# EAGLE design double100 (EAGLE 6.6.0)
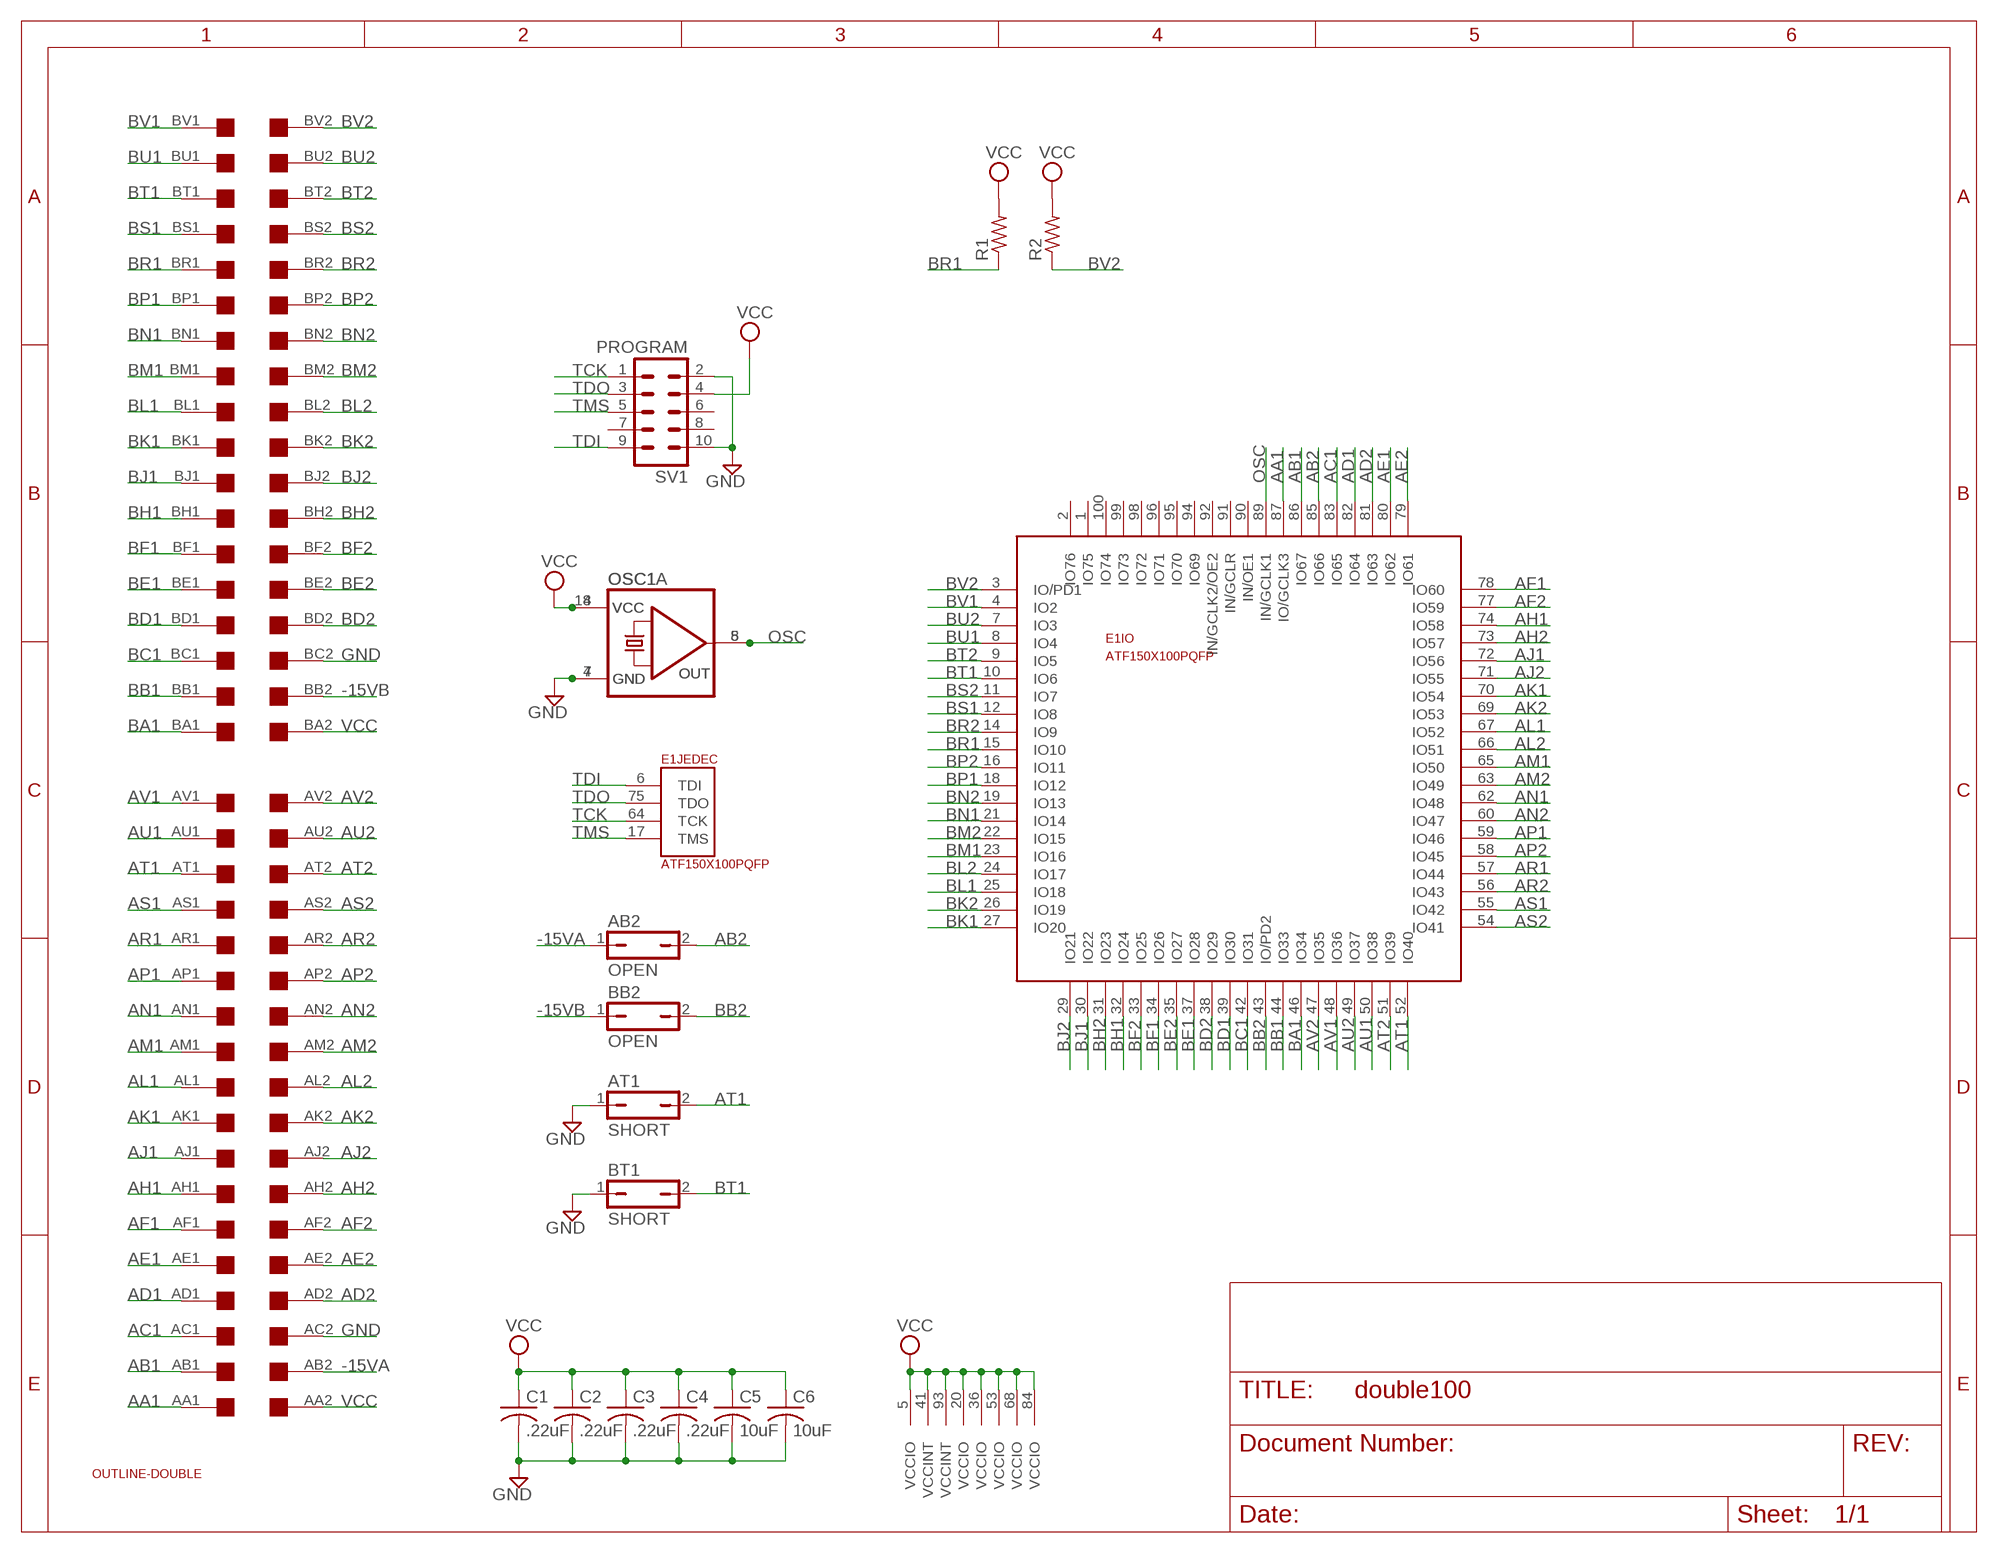
[diagram p0: schematic, sheet 1]

## Parts
AB2  OPEN  JP1Q  [JP1]
AT1  SHORT  JP1Q  [JP1]
BB2  OPEN  JP1Q  [JP1]
BT1  SHORT  JP1Q  [JP1]
C1  .22uF  C-USC0805  [C0805]
C2  .22uF  C-USC0805  [C0805]
C3  .22uF  C-USC0805  [C0805]
C4  .22uF  C-USC0805  [C0805]
C5  10uF  C-USC0805  [C0805]
C6  10uF  C-USC0805  [C0805]
E1  ATF150X100PQFP  [PQFP-100]
OSC1  QG5460  [DIL08S]
OSC1A  QG5860  [DIL14S]
R1  R-US_0207/10  [0207/10]
R2  R-US_0207/10  [0207/10]
SV1  PROGRAM  ML10  [ML10]
U$1  DOUBLE  [EDGE-CON4]
U$3  OUTLINE-DOUBLE  [DOUBLE]

## Nets
-15VA: AB2.1 U$1.AB2
-15VB: BB2.1 U$1.BB2
AA1: E1.87(IO:IO/GCLK3) U$1.AA1
AB1: E1.86(IO:IO67) U$1.AB1
AB2: AB2.2 E1.85(IO:IO66)
AC1: E1.83(IO:IO65) U$1.AC1
AD1: E1.82(IO:IO64) U$1.AD1
AD2: E1.81(IO:IO63) U$1.AD2
AE1: E1.80(IO:IO62) U$1.AE1
AE2: E1.79(IO:IO61) U$1.AE2
AF1: E1.78(IO:IO60) U$1.AF1
AF2: E1.77(IO:IO59) U$1.AF2
AH1: E1.74(IO:IO58) U$1.AH1
AH2: E1.73(IO:IO57) U$1.AH2
AJ1: E1.72(IO:IO56) U$1.AJ1
AJ2: E1.71(IO:IO55) U$1.AJ2
AK1: E1.70(IO:IO54) U$1.AK1
AK2: E1.69(IO:IO53) U$1.AK2
AL1: E1.67(IO:IO52) U$1.AL1
AL2: E1.66(IO:IO51) U$1.AL2
AM1: E1.65(IO:IO50) U$1.AM1
AM2: E1.63(IO:IO49) U$1.AM2
AN1: E1.62(IO:IO48) U$1.AN1
AN2: E1.60(IO:IO47) U$1.AN2
AP1: E1.59(IO:IO46) U$1.AP1
AP2: E1.58(IO:IO45) U$1.AP2
AR1: E1.57(IO:IO44) U$1.AR1
AR2: E1.56(IO:IO43) U$1.AR2
AS1: E1.55(IO:IO42) U$1.AS1
AS2: E1.54(IO:IO41) U$1.AS2
AT1: AT1.2 E1.52(IO:IO40) U$1.AT1
AT2: E1.51(IO:IO39) U$1.AT2
AU1: E1.50(IO:IO38) U$1.AU1
AU2: E1.49(IO:IO37) U$1.AU2
AV1: E1.48(IO:IO36) U$1.AV1
AV2: E1.47(IO:IO35) U$1.AV2
BA1: E1.46(IO:IO34) U$1.BA1
BB1: E1.44(IO:IO33) U$1.BB1
BB2: BB2.2 E1.43(IO:IO/PD2)
BC1: E1.42(IO:IO31) U$1.BC1
BD1: E1.39(IO:IO30) U$1.BD1
BD2: E1.38(IO:IO29) U$1.BD2
BE1: E1.37(IO:IO28) U$1.BE1
BE2: E1.35(IO:IO27) U$1.BE2
BF1: E1.34(IO:IO26) U$1.BF1
BF2: E1.33(IO:IO25) U$1.BF2
BH1: E1.32(IO:IO24) U$1.BH1
BH2: E1.31(IO:IO23) U$1.BH2
BJ1: E1.30(IO:IO22) U$1.BJ1
BJ2: E1.29(IO:IO21) U$1.BJ2
BK1: E1.27(IO:IO20) U$1.BK1
BK2: E1.26(IO:IO19) U$1.BK2
BL1: E1.25(IO:IO18) U$1.BL1
BL2: E1.24(IO:IO17) U$1.BL2
BM1: E1.23(IO:IO16) U$1.BM1
BM2: E1.22(IO:IO15) U$1.BM2
BN1: E1.21(IO:IO14) U$1.BN1
BN2: E1.19(IO:IO13) U$1.BN2
BP1: E1.18(IO:IO12) U$1.BP1
BP2: E1.16(IO:IO11) U$1.BP2
BR1: E1.15(IO:IO10) R1.1 U$1.BR1
BR2: E1.14(IO:IO9) U$1.BR2
BS1: E1.12(IO:IO8) U$1.BS1
BS2: E1.11(IO:IO7) U$1.BS2
BT1: BT1.2 E1.10(IO:IO6) U$1.BT1
BT2: E1.9(IO:IO5) U$1.BT2
BU1: E1.8(IO:IO4) U$1.BU1
BU2: E1.7(IO:IO3) U$1.BU2
BV1: E1.4(IO:IO2) U$1.BV1
BV2: E1.3(IO:IO/PD1) R2.1 U$1.BV2
GND: AT1.1 BT1.1 C1.2 C2.2 C3.2 C4.2 C5.2 C6.2 OSC1.4(GND) OSC1A.7(GND) SV1.2 SV1.10 U$1.AC2 U$1.BC2
OSC: E1.89(IO:IN/GCLK1) OSC1.5(OUT) OSC1A.8(OUT)
TCK: E1.64(JEDEC:TCK) SV1.1
TDI: E1.6(JEDEC:TDI) SV1.9
TDO: E1.75(JEDEC:TDO) SV1.3
TMS: E1.17(JEDEC:TMS) SV1.5
VCC: C1.1 C2.1 C3.1 C4.1 C5.1 C6.1 E1.5(VCCIO) E1.20(VCCIO) E1.36(VCCIO) E1.41(VCCINT) E1.53(VCCIO) E1.68(VCCIO) E1.84(VCCIO) E1.93(VCCINT) OSC1.8(VCC) OSC1A.14(VCC) R1.2 R2.2 SV1.4 U$1.AA2 U$1.BA2
Unconnected: E1.1(IO:IO75) E1.2(IO:IO76) E1.90(IO:IN/OE1) E1.91(IO:IN/GCLR) E1.92(IO:IN/GCLK2/OE2) E1.94(IO:IO69) E1.95(IO:IO70) E1.96(IO:IO71) E1.98(IO:IO72) E1.99(IO:IO73) E1.100(IO:IO74) SV1.6 SV1.7 SV1.8

## Power pins joined to a net without a drawn wire
GND: E1.13(GND) E1.28(GND) E1.40(GND) E1.45(GND) E1.61(GND) E1.76(GND) E1.88(GND) E1.97(GND)

## Library data of the parts
AB2 AT1 BB2 BT1 = jumper:JP1Q: JUMPER
C1-C6 = rcl:C-US: CAPACITOR, American symbol
E1 = atmel-cpld:ATF150X100: ATF150x in 100 pin package.
OSC1 = crystal:QG5460: CRYSTAL RESONATOR; OC_FARNELL: unknown; OC_NEWARK: unknown
OSC1A = crystal:QG5860: CRYSTAL RESONATOR; OC_FARNELL: unknown; OC_NEWARK: unknown
R1 R2 = rcl:R-US_: RESISTOR, American symbol
SV1 = con-harting-ml:ML10: HARTING; OC_FARNELL: unknown; OC_NEWARK: unknown
U$1 = dec-con:DOUBLE: Double-Height DEC board
U$3 = dec-con:OUTLINE-*: Board outlines for DEC boards.

## Net classes
1 Supply: width 0.711 mm

## Board
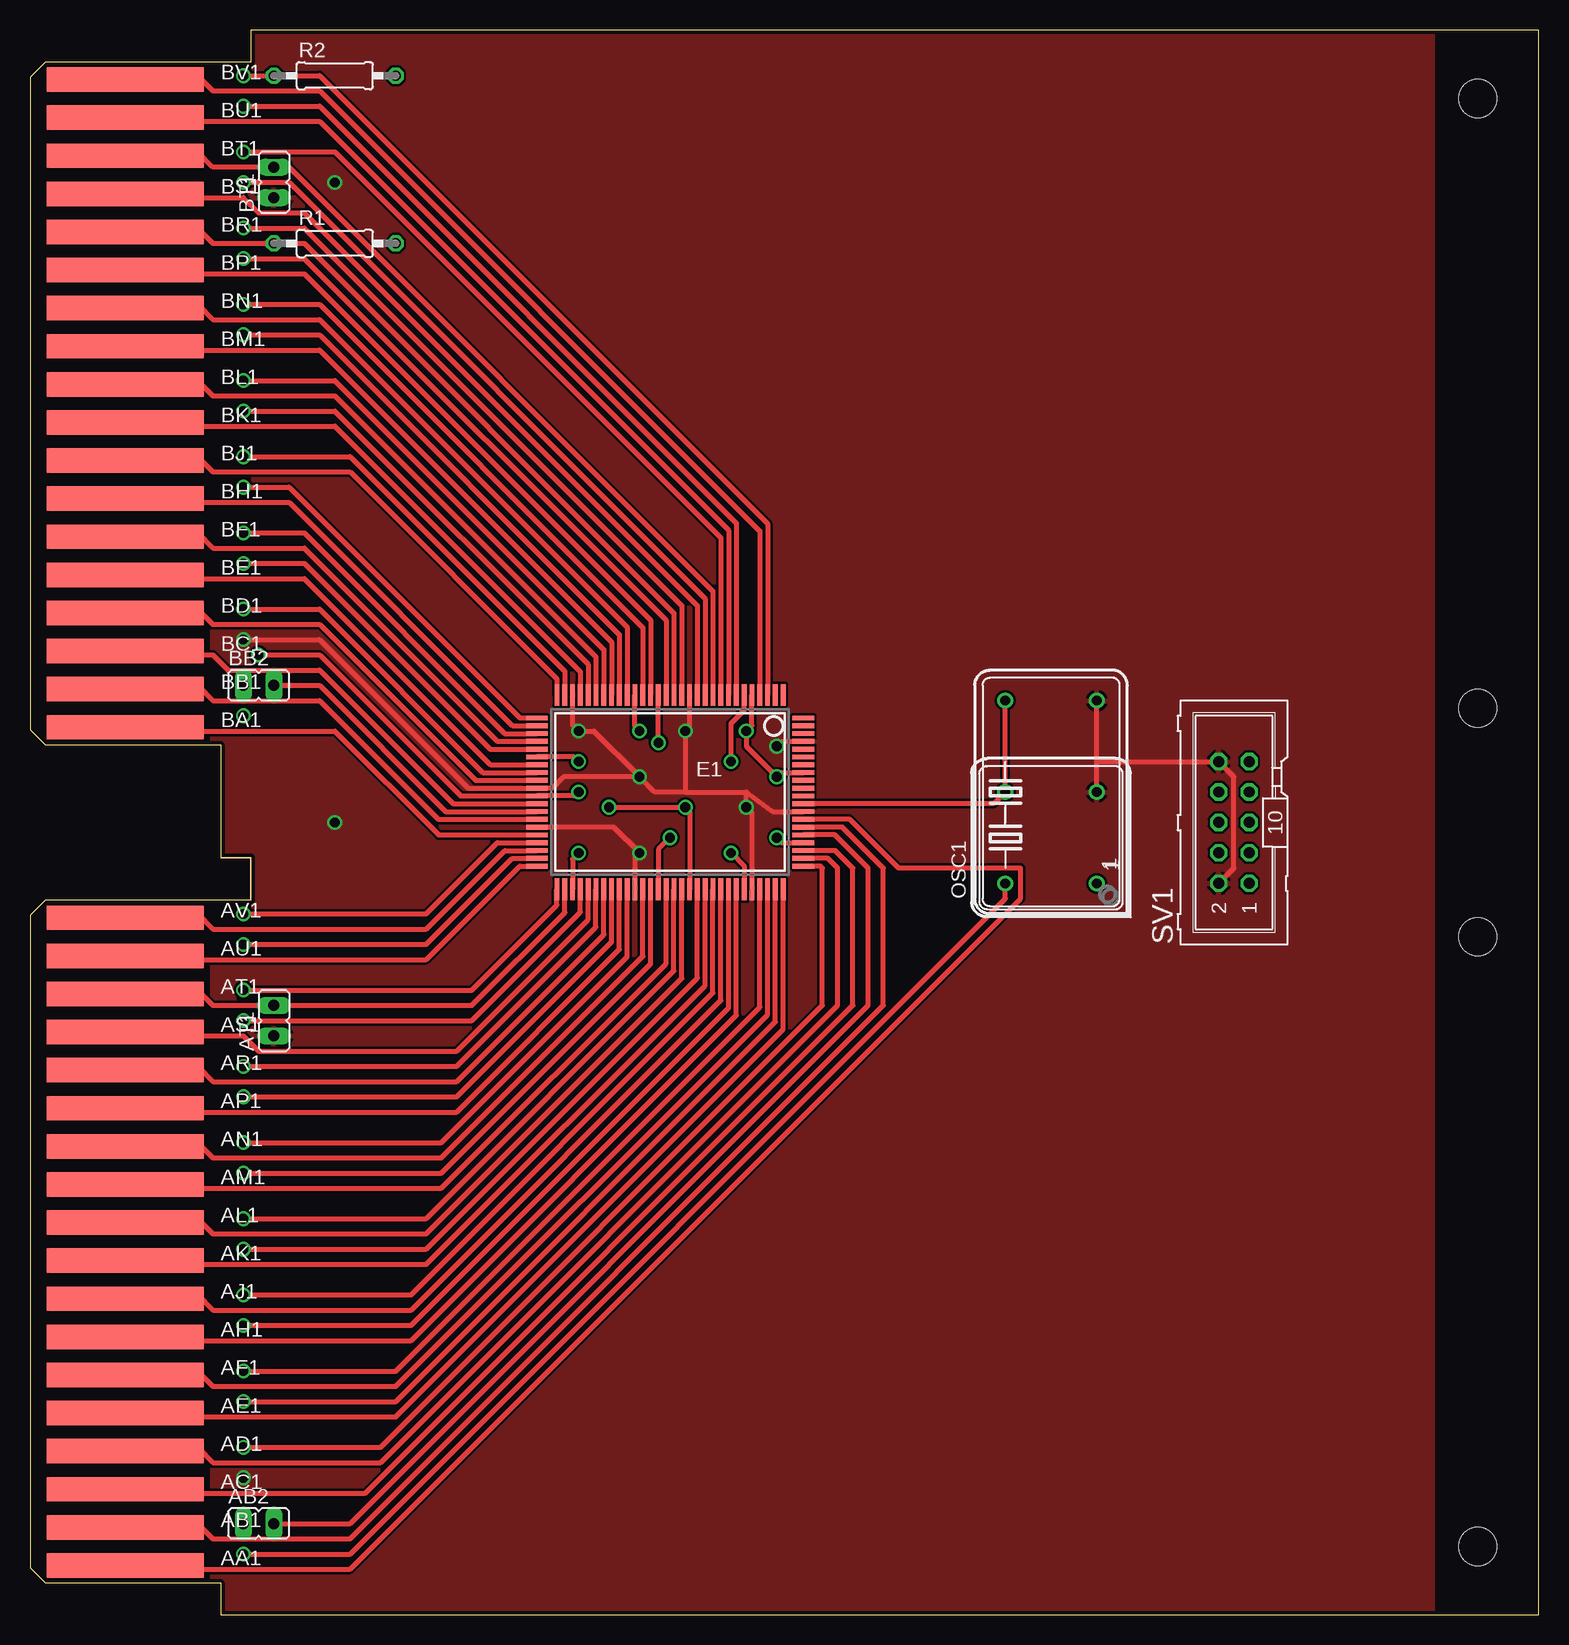
[diagram p1: board, top side]
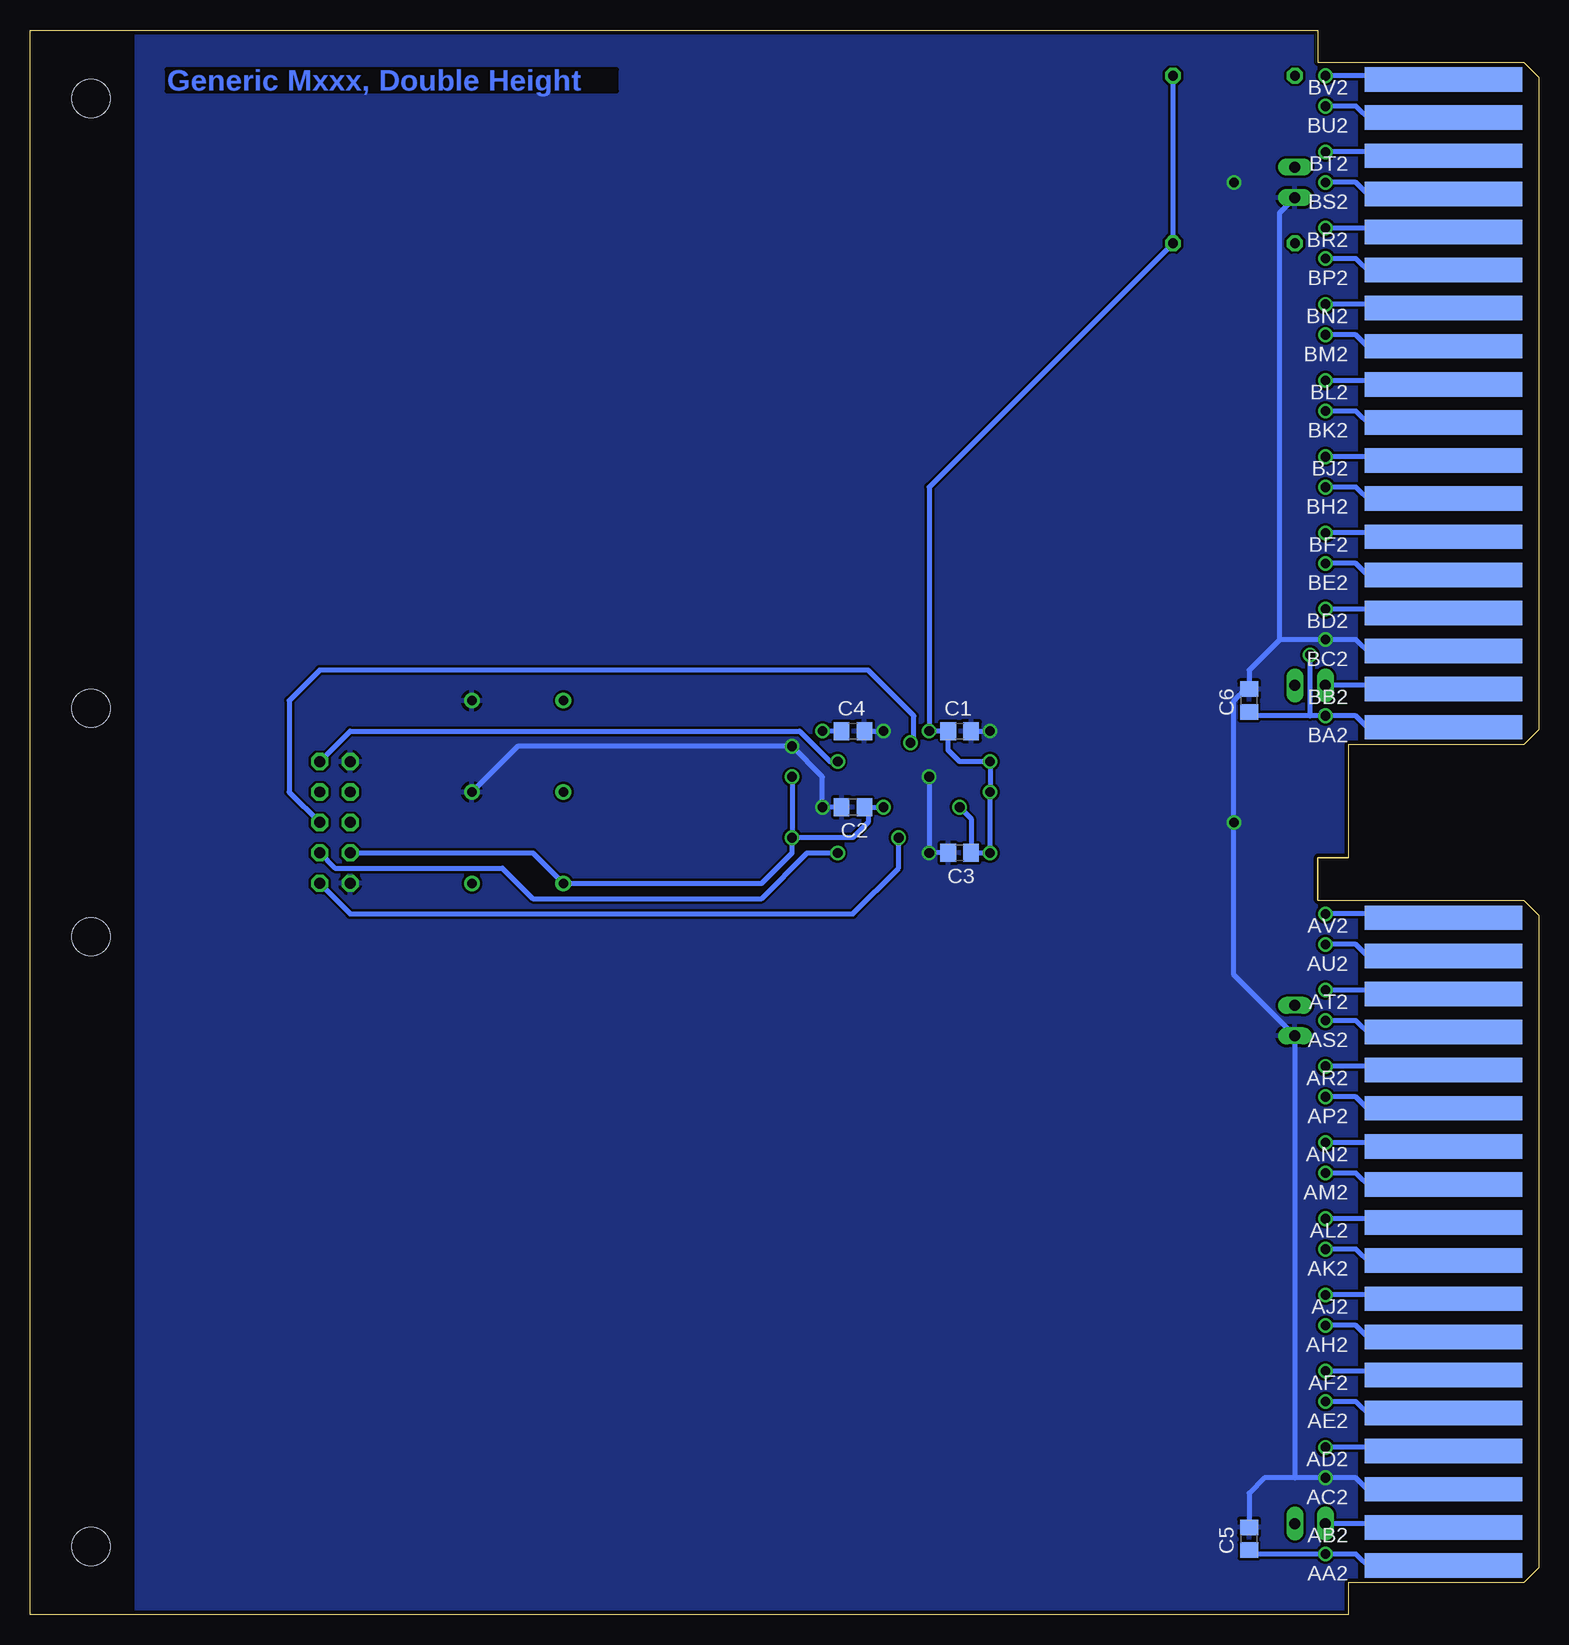
[diagram p2: board, bottom side, seen from below]

Size 125.73 x 132.08 mm. Coordinates in mm from the lower left corner, seen from the top.
Copper layers (1+16): Top 0.035mm / dielectric 1.5mm / Bottom 0.035mm
Design rules "16mils *": minimum track width 15mil, minimum drill 32mil, track to track 8mil, track to pad 8mil, pad to pad 8mil, via to via 10mil, smd to smd 8mil, copper to edge 13mil, drill to drill 10mil, minimum pad ring 10mil, minimum via ring 8mil, stop-mask expansion 0mil, vias tented up to drill 0mil, thermal gap 10mil

### Footprints (pad centres in the part's own frame; a part is rotated, then mirrored left to right if it is on the bottom)
JP1 = drill 0.914 long: 1 0,-1.27; 2 0,1.27
C0805 = smd 1.3 x 1.5: 1 -0.95,0; 2 0.95,0
PQFP-100 = smd 0.4 x 1.8: 1 -9.425,-8.1; 2 -8.775,-8.1; 3 -8.125,-8.1; 4 -7.475,-8.1; 5 -6.825,-8.1; 6 -6.175,-8.1; 7 -5.525,-8.1; 8 -4.875,-8.1; 9 -4.225,-8.1; 10 -3.575,-8.1; 11 -2.925,-8.1; 12 -2.275,-8.1; 13 -1.625,-8.1; 14 -0.975,-8.1; 15 -0.325,-8.1; 16 0.325,-8.1; 17 0.975,-8.1; 18 1.625,-8.1; 19 2.275,-8.1; 20 2.925,-8.1; 21 3.575,-8.1; 22 4.225,-8.1; 23 4.875,-8.1; 24 5.525,-8.1; 25 6.175,-8.1; 26 6.825,-8.1; 27 7.475,-8.1; 28 8.125,-8.1; 29 8.775,-8.1; 30 9.425,-8.1; 51 9.425,8.1; 52 8.775,8.1; 53 8.125,8.1; 54 7.475,8.1; 55 6.825,8.1; 56 6.175,8.1; 57 5.525,8.1; 58 4.875,8.1; 59 4.225,8.1; 60 3.575,8.1; 61 2.925,8.1; 62 2.275,8.1; 63 1.625,8.1; 64 0.975,8.1; 65 0.325,8.1; 66 -0.325,8.1; 67 -0.975,8.1; 68 -1.625,8.1; 69 -2.275,8.1; 70 -2.925,8.1; 71 -3.575,8.1; 72 -4.225,8.1; 73 -4.875,8.1; 74 -5.525,8.1; 75 -6.175,8.1; 76 -6.825,8.1; 77 -7.475,8.1; 78 -8.125,8.1; 79 -8.775,8.1; 80 -9.425,8.1 | smd 1.8 x 0.4: 31 11.1,-6.175; 32 11.1,-5.525; 33 11.1,-4.875; 34 11.1,-4.225; 35 11.1,-3.575; 36 11.1,-2.925; 37 11.1,-2.275; 38 11.1,-1.625; 39 11.1,-0.975; 40 11.1,-0.325; 41 11.1,0.325; 42 11.1,0.975; 43 11.1,1.625; 44 11.1,2.275; 45 11.1,2.925; 46 11.1,3.575; 47 11.1,4.225; 48 11.1,4.875; 49 11.1,5.525; 50 11.1,6.175; 81 -11.1,6.175; 82 -11.1,5.525; 83 -11.1,4.875; 84 -11.1,4.225; 85 -11.1,3.575; 86 -11.1,2.925; 87 -11.1,2.275; 88 -11.1,1.625; 89 -11.1,0.975; 90 -11.1,0.325; 91 -11.1,-0.325; 92 -11.1,-0.975; 93 -11.1,-1.625; 94 -11.1,-2.275; 95 -11.1,-2.925; 96 -11.1,-3.575; 97 -11.1,-4.225; 98 -11.1,-4.875; 99 -11.1,-5.525; 100 -11.1,-6.175
DIL08S = drill 0.813: 1 -3.81,-3.81; 4 3.81,-3.81; 5 3.81,3.81; 8 -3.81,3.81
DIL14S = drill 0.813: 1 -7.62,-3.81; 7 7.62,-3.81; 8 7.62,3.81; 14 -7.62,3.81
0207/10 = drill 0.813 octagon: 1 -5.08,0; 2 5.08,0
ML10 = drill 0.914 octagon: 1 -5.08,-1.27; 2 -5.08,1.27; 3 -2.54,-1.27; 4 -2.54,1.27; 5 0,-1.27; 6 0,1.27; 7 2.54,-1.27; 8 2.54,1.27; 9 5.08,-1.27; 10 5.08,1.27
EDGE-CON4 = smd 13.106 x 2.032: AA1 7.938,4.128; AB1 7.938,7.303; AC1 7.938,10.477; AD1 7.938,13.652; AE1 7.938,16.828; AF1 7.938,20.003; AH1 7.938,23.177; AJ1 7.938,26.352; AK1 7.938,29.527; AL1 7.938,32.703; AM1 7.938,35.877; AN1 7.938,39.053; AP1 7.938,42.227; AR1 7.938,45.403; AS1 7.938,48.578; AT1 7.938,51.752; AU1 7.938,54.928; AV1 7.938,58.102; BA1 7.938,73.978; BB1 7.938,77.153; BC1 7.938,80.328; BD1 7.938,83.502; BE1 7.938,86.677; BF1 7.938,89.853; BH1 7.938,93.028; BJ1 7.938,96.203; BK1 7.938,99.377; BL1 7.938,102.552; BM1 7.938,105.728; BN1 7.938,108.903; BP1 7.938,112.078; BR1 7.938,115.252; BS1 7.938,118.427; BT1 7.938,121.603; BU1 7.938,124.778; BV1 7.938,127.953 | smd 13.106 x 2.032 bottom: AA2 7.938,4.128; AB2 7.938,7.303; AC2 7.938,10.477; AD2 7.938,13.652; AE2 7.938,16.828; AF2 7.938,20.003; AH2 7.938,23.177; AJ2 7.938,26.352; AK2 7.938,29.527; AL2 7.938,32.703; AM2 7.938,35.877; AN2 7.938,39.053; AP2 7.938,42.227; AR2 7.938,45.403; AS2 7.938,48.578; AT2 7.938,51.752; AU2 7.938,54.928; AV2 7.938,58.102; BA2 7.938,73.978; BB2 7.938,77.153; BC2 7.938,80.328; BD2 7.938,83.502; BE2 7.938,86.677; BF2 7.938,89.853; BH2 7.938,93.028; BJ2 7.938,96.203; BK2 7.938,99.377; BL2 7.938,102.552; BM2 7.938,105.728; BN2 7.938,108.903; BP2 7.938,112.078; BR2 7.938,115.252; BS2 7.938,118.427; BT2 7.938,121.603; BU2 7.938,124.778; BV2 7.938,127.953
DOUBLE = hole 3.175: 120.65,56.515; 120.65,5.715; 120.65,75.565; 120.65,126.365

### Placement (x,y rotation side)
AB2  19.05,7.62 270 top
AT1  20.32,49.53 0 top
BB2  19.05,77.47 270 top
BT1  20.32,119.38 0 top
C1  48.26,73.66 0 bottom
C2  57.15,67.31 180 bottom
C3  48.26,63.5 180 bottom
C4  57.15,73.66 0 bottom
C5  24.13,6.35 90 bottom
C6  24.13,76.2 90 bottom
E1  53.34,68.58 180 top
OSC1  85.09,64.77 90 top
OSC1A  85.09,68.58 90 top
R1  25.4,114.3 0 top
R2  25.4,128.27 0 top
SV1  100.33,66.04 90 top
U$1  0,0 0 top
U$3  0,0 0 top

### Tracks (layer width: path | path; a pad name or v marks a point on that pad's centre or on a via)
-15VA
  Bottom 0.406: U$1.AB2 8.26,7.62 AB2.1
-15VB
  Bottom 0.406: U$1.BB2 8.26,77.47 BB2.1
AA1
  Top 0.406: U$1.AA1 8.26,3.81 26.67,3.81 82.55,59.69 82.55,62.23 72.39,62.23 68.32,66.31 E1.87
AB1
  Top 0.406: U$1.AB1 8.26,7.62 13.97,7.62 15.24,6.35 26.67,6.35 71.12,50.8 71.12,62.23 67.7,65.66 E1.86
AB2
  Top 0.406: AB2.2 26.67,7.62 69.85,50.8 69.85,62.23 67.08,65 E1.85
AC1
  Top 0.406: U$1.AC1 8.26,10.16 27.94,10.16 68.58,50.8 68.58,62.23 67.11,63.7 E1.83
AD1
  Top 0.406: U$1.AD1 8.26,13.97 13.97,13.97 15.24,12.7 29.21,12.7 67.31,50.8 67.31,62.23 66.49,63.05 E1.82
AD2  (via drill 0.81)
  Top 0.406: v17.78,13.97 29.21,13.97 66.04,50.8 66.04,62.23 65.87,62.41 E1.81
  Bottom 0.406: U$1.AD2 8.26,13.97 v17.78,13.97
AE1
  Top 0.406: U$1.AE1 8.26,16.51 30.48,16.51 62.77,48.8 E1.80
AE2  (via drill 0.81)
  Top 0.406: v17.78,17.78 30.48,17.78 62.12,49.41 E1.79
  Bottom 0.406: U$1.AE2 8.26,16.51 13.97,16.51 15.24,17.78 v17.78,17.78
AF1
  Top 0.406: U$1.AF1 8.26,20.32 13.97,20.32 15.24,19.05 30.48,19.05 61.47,50.03 E1.78
AF2  (via drill 0.81)
  Top 0.406: v17.78,20.32 30.48,20.32 60.82,50.66 E1.77
  Bottom 0.406: U$1.AF2 8.26,20.32 v17.78,20.32
AH1
  Top 0.406: U$1.AH1 8.26,22.86 31.75,22.86 58.87,49.98 E1.74
AH2  (via drill 0.81)
  Top 0.406: v17.78,24.13 31.75,24.13 58.22,50.59 E1.73
  Bottom 0.406: U$1.AH2 8.26,22.86 13.97,22.86 15.24,24.13 v17.78,24.13
AJ1
  Top 0.406: U$1.AJ1 8.26,26.67 13.97,26.67 15.24,25.4 31.75,25.4 57.57,51.22 E1.72
AJ2  (via drill 0.81)
  Top 0.406: v17.78,26.67 31.75,26.67 56.92,51.84 E1.71
  Bottom 0.406: U$1.AJ2 8.26,26.67 v17.78,26.67
AK1
  Top 0.406: U$1.AK1 8.26,29.21 33.02,29.21 56.27,52.45 E1.70
AK2  (via drill 0.81)
  Top 0.406: v17.78,30.48 33.02,30.48 55.62,53.08 E1.69
  Bottom 0.406: U$1.AK2 8.26,29.21 13.97,29.21 15.24,30.48 v17.78,30.48
AL1
  Top 0.406: U$1.AL1 8.26,33.02 13.97,33.02 15.24,31.75 33.02,31.75 54.32,53.05 E1.67
AL2  (via drill 0.81)
  Top 0.406: v17.78,33.02 33.02,33.02 53.67,53.66 E1.66
  Bottom 0.406: U$1.AL2 8.26,33.02 v17.78,33.02
AM1
  Top 0.406: U$1.AM1 8.26,35.56 34.29,35.56 53.02,54.28 E1.65
AM2  (via drill 0.81)
  Top 0.406: v17.78,36.83 34.29,36.83 51.72,54.26 E1.63
  Bottom 0.406: U$1.AM2 8.26,35.56 13.97,35.56 15.24,36.83 v17.78,36.83
AN1
  Top 0.406: U$1.AN1 8.26,39.37 13.97,39.37 15.24,38.1 34.29,38.1 51.07,54.88 E1.62
AN2  (via drill 0.81)
  Top 0.406: v17.78,39.37 34.29,39.37 49.77,54.84 E1.60
  Bottom 0.406: U$1.AN2 8.26,39.37 v17.78,39.37
AP1
  Top 0.406: U$1.AP1 8.26,41.91 35.56,41.91 49.12,55.47 E1.59
AP2  (via drill 0.81)
  Top 0.406: v17.78,43.18 35.56,43.18 48.47,56.09 E1.58
  Bottom 0.406: U$1.AP2 8.26,41.91 13.97,41.91 15.24,43.18 v17.78,43.18
AR1
  Top 0.406: U$1.AR1 8.26,45.72 13.97,45.72 15.24,44.45 35.56,44.45 47.82,56.7 E1.57
AR2  (via drill 0.81)
  Top 0.406: v17.78,45.72 35.56,45.72 47.17,57.33 E1.56
  Bottom 0.406: U$1.AR2 8.26,45.72 v17.78,45.72
AS1
  Top 0.406: U$1.AS1 8.26,48.26 17.78,48.26 19.05,46.99 35.56,46.99 46.52,57.95 E1.55
AS2  (via drill 0.81)
  Top 0.406: v17.78,49.53 36.83,49.53 45.87,58.56 E1.54
  Bottom 0.406: U$1.AS2 8.26,48.26 13.97,48.26 15.24,49.53 v17.78,49.53
AT1
  Top 0.406: U$1.AT1 8.26,52.07 13.97,52.07 15.24,50.8 AT1.2 36.83,50.8 44.57,58.53 E1.52
AT2  (via drill 0.81)
  Top 0.406: v17.78,52.07 36.83,52.07 43.92,59.16 E1.51
  Bottom 0.406: U$1.AT2 8.26,52.07 v17.78,52.07
AU1
  Top 0.406: U$1.AU1 8.26,54.61 33.02,54.61 40.82,62.41 E1.50
AU2  (via drill 0.81)
  Top 0.406: v17.78,55.88 33.02,55.88 40.2,63.05 E1.49
  Bottom 0.406: U$1.AU2 8.26,54.61 13.97,54.61 15.24,55.88 v17.78,55.88
AV1
  Top 0.406: U$1.AV1 8.26,58.42 13.97,58.42 15.24,57.15 33.02,57.15 39.58,63.7 E1.48
AV2  (via drill 0.81)
  Top 0.406: v17.78,58.42 33.02,58.42 38.96,64.36 E1.47
  Bottom 0.406: U$1.AV2 8.26,58.42 v17.78,58.42
BA1
  Top 0.406: U$1.BA1 8.26,73.66 25.4,73.66 34.06,65 E1.46
BB1
  Top 0.406: U$1.BB1 8.26,77.47 13.97,77.47 15.24,76.2 24.13,76.2 34.03,66.31 E1.44
BB2
  Top 0.406: BB2.2 24.13,77.47 34.65,66.95 E1.43
BC1
  Top 0.406: U$1.BC1 8.26,80.01 15.24,80.01 16.51,78.74 24.13,78.74 35.27,67.61 E1.42
BD1
  Top 0.406: U$1.BD1 8.26,83.82 13.97,83.82 15.24,82.55 24.13,82.55 37.13,69.56 E1.39
BD2  (via drill 0.81)
  Top 0.406: v17.78,83.82 24.13,83.82 37.75,70.2 E1.38
  Bottom 0.406: U$1.BD2 8.26,83.82 v17.78,83.82
BE1
  Top 0.406: U$1.BE1 8.26,86.36 22.86,86.36 38.37,70.86 E1.37
BE2  (via drill 0.81)
  Top 0.406: v17.78,87.63 22.86,87.63 38.34,72.16 E1.35
  Bottom 0.406: U$1.BE2 8.26,86.36 13.97,86.36 15.24,87.63 v17.78,87.63
BF1
  Top 0.406: U$1.BF1 8.26,90.17 13.97,90.17 15.24,88.9 22.86,88.9 38.96,72.81 E1.34
BF2  (via drill 0.81)
  Top 0.406: v17.78,90.17 22.86,90.17 39.58,73.45 E1.33
  Bottom 0.406: U$1.BF2 8.26,90.17 v17.78,90.17
BH1
  Top 0.406: U$1.BH1 8.26,92.71 21.59,92.71 40.2,74.11 E1.32
BH2  (via drill 0.81)
  Top 0.406: v17.78,93.98 21.59,93.98 40.82,74.75 E1.31
  Bottom 0.406: U$1.BH2 8.26,92.71 13.97,92.71 15.24,93.98 v17.78,93.98
BJ1
  Top 0.406: U$1.BJ1 8.26,96.52 13.97,96.52 15.24,95.25 26.67,95.25 43.92,78 E1.30
BJ2  (via drill 0.81)
  Top 0.406: v17.78,96.52 26.67,96.52 44.57,78.62 E1.29
  Bottom 0.406: U$1.BJ2 8.26,96.52 v17.78,96.52
BK1
  Top 0.406: U$1.BK1 8.26,99.06 25.4,99.06 45.87,78.59 E1.27
BK2  (via drill 0.81)
  Top 0.406: v17.78,100.33 25.4,100.33 46.52,79.22 E1.26
  Bottom 0.406: U$1.BK2 8.26,99.06 13.97,99.06 15.24,100.33 v17.78,100.33
BL1
  Top 0.406: U$1.BL1 8.26,102.87 13.97,102.87 15.24,101.6 25.4,101.6 47.17,79.83 E1.25
BL2  (via drill 0.81)
  Top 0.406: v17.78,102.87 25.4,102.87 47.82,80.45 E1.24
  Bottom 0.406: U$1.BL2 8.26,102.87 v17.78,102.87
BM1
  Top 0.406: U$1.BM1 8.26,105.41 24.13,105.41 48.47,81.08 E1.23
BM2  (via drill 0.81)
  Top 0.406: v17.78,106.68 24.13,106.68 49.12,81.69 E1.22
  Bottom 0.406: U$1.BM2 8.26,105.41 13.97,105.41 15.24,106.68 v17.78,106.68
BN1
  Top 0.406: U$1.BN1 8.26,109.22 13.97,109.22 15.24,107.95 24.13,107.95 49.77,82.31 E1.21
BN2  (via drill 0.81)
  Top 0.406: v17.78,109.22 24.13,109.22 51.07,82.28 E1.19
  Bottom 0.406: U$1.BN2 8.26,109.22 v17.78,109.22
BP1
  Top 0.406: U$1.BP1 8.26,111.76 22.86,111.76 51.72,82.91 E1.18
BP2  (via drill 0.81)
  Top 0.406: v17.78,113.03 22.86,113.03 53.02,82.88 E1.16
  Bottom 0.406: U$1.BP2 8.26,111.76 13.97,111.76 15.24,113.03 v17.78,113.03
BR1
  Top 0.406: U$1.BR1 8.26,115.57 13.97,115.57 15.24,114.3 R1.1 22.86,114.3 53.67,83.5 E1.15
BR2  (via drill 0.81)
  Top 0.406: v17.78,115.57 22.86,115.57 54.32,84.11 E1.14
  Bottom 0.406: U$1.BR2 8.26,115.57 v17.78,115.57
BS1
  Top 0.406: U$1.BS1 8.26,118.11 17.78,118.11 19.05,116.84 22.86,116.84 55.62,84.08 E1.12
BS2  (via drill 0.81)
  Top 0.406: v17.78,119.38 21.59,119.38 56.27,84.7 E1.11
  Bottom 0.406: U$1.BS2 8.26,118.11 13.97,118.11 15.24,119.38 v17.78,119.38
BT1
  Top 0.406: U$1.BT1 8.26,121.92 13.97,121.92 15.24,120.65 BT1.2 21.59,120.65 56.92,85.33 E1.10
BT2  (via drill 0.81)
  Top 0.406: v17.78,121.92 25.4,121.92 57.57,89.75 E1.9
  Bottom 0.406: U$1.BT2 8.26,121.92 v17.78,121.92
BU1
  Top 0.406: U$1.BU1 8.26,124.46 24.13,124.46 58.22,90.38 E1.8
BU2  (via drill 0.81)
  Top 0.406: v17.78,125.73 24.13,125.73 58.87,91 E1.7
  Bottom 0.406: U$1.BU2 8.26,124.46 13.97,124.46 15.24,125.73 v17.78,125.73
BV1
  Top 0.406: U$1.BV1 8.26,128.27 13.97,128.27 15.24,127 24.13,127 60.82,90.31 E1.4
BV2  (via drill 0.81)
  Top 0.406: v17.78,128.27 R2.1 24.13,128.27 61.47,90.94 E1.3
  Bottom 0.406: U$1.BV2 8.26,128.27 v17.78,128.27
GND  (via drill 0.81)
  Top 0.406: 88.9,71.12 OSC1A.7 | E1.61 50.42,63.12 v50.8,63.5 48.65,65.66 E1.45 | E1.76 60.17,66.83 v59.69,67.31 59.69,68.58 | E1.28 45.22,74.17 v45.72,73.66 46.99,73.66 v50.8,69.85 | E1.13 54.97,74.02 v54.61,73.66 54.61,68.58 | SV1.2 100.33,62.23 100.33,69.85 SV1.10 88.9,71.12 | OSC1.4 88.9,71.12 | 54.61,68.58 52.07,68.58 v50.8,69.85 | 59.69,68.58 61.88,66.95 E1.88 | v62.23,72.39 62.65,72.81 E1.97 | v50.8,69.85 44.45,69.85 43.51,68.91 E1.40 36.51,68.91 24.13,81.28 v17.78,81.28 | 54.61,68.58 59.69,68.58
  Bottom 0.406: C1.2 v45.72,73.66 | C4.2 v54.61,73.66 | C2.2 v59.69,67.31 59.69,69.85 v62.23,72.39 85.09,72.39 OSC1.4 | C3.2 v50.8,63.5 v50.8,69.85 | U$1.BC2 8.26,80.01 13.97,80.01 15.24,81.28 v17.78,81.28 21.59,81.28 | 21.59,81.28 24.13,78.74 C6.2 24.45,77.15 25.4,76.2 v25.4,66.04 25.4,53.34 AT1.1 20.32,11.43 | U$1.AC2 8.26,10.16 13.97,10.16 15.24,11.43 v17.78,11.43 20.32,11.43 | 20.32,11.43 22.86,11.43 24.13,10.16 C5.2 | 21.59,81.28 21.59,116.84 BT1.1
  other vias: 25.4,119.38
  pour Top: 15.24,0 15.24,132.08 116.84,132.08 116.84,0
  pour Bottom: 15.24,0 15.24,132.08 116.84,132.08 116.84,0
OSC
  Top 0.406: OSC1A.8 OSC1.5 80.31,67.61 E1.89
TCK  (via drill 0.81)
  Top 0.406: v53.34,64.77 52.37,63.8 E1.64
  Bottom 0.406: SV1.1 99.06,58.42 57.15,58.42 53.34,62.23 v53.34,64.77
TDI  (via drill 0.81)
  Top 0.406: v58.42,71.12 58.42,74.3 59.52,75.39 E1.6
  Bottom 0.406: SV1.9 99.06,73.66 61.6,73.66 59.06,71.12 v58.42,71.12
TDO  (via drill 0.81)
  Top 0.406: v58.42,63.5 59.52,62.41 E1.75
  Bottom 0.406: SV1.3 100.33,62.23 86.36,62.23 83.82,59.69 64.77,59.69 60.96,63.5 v58.42,63.5
TMS  (via drill 0.81)
  Top 0.406: v52.37,72.69 E1.17
  Bottom 0.406: v52.37,72.69 52.07,72.98 52.07,74.93 55.88,78.74 101.6,78.74 104.14,76.2 104.14,68.58 SV1.5
VCC  (via drill 0.81)
  Top 0.406: v45.72,63.5 45.22,62.99 E1.53 | E1.68 54.97,66.95 v54.61,67.31 v48.26,67.31 | v50.8,73.66 50.42,74.05 E1.20 | E1.5 60.17,74.14 v59.69,73.66 59.69,72.39 v62.23,69.85 62.59,70.2 E1.93 | v45.72,71.12 45.34,71.5 E1.36 | v45.72,68.58 45.4,68.25 E1.41 35.89,68.25 24.13,80.01 v19.05,80.01 | v62.23,64.77 62.65,64.36 E1.84 | v17.78,5.08 26.67,5.08 81.28,59.69 OSC1.8
  Bottom 0.406: C4.1 v59.69,73.66 | v54.61,67.31 C2.1 55.88,66.99 55.88,66.04 57.15,64.77 v62.23,64.77 | SV1.4 83.82,63.5 OSC1.8 64.77,60.96 62.23,63.5 v62.23,64.77 | v48.26,67.31 47.31,66.36 C3.1 v45.72,63.5 v45.72,68.58 v45.72,71.12 48.26,71.12 49.21,72.07 C1.1 v50.8,73.66 50.8,93.98 R1.2 R2.2 | v62.23,69.85 v62.23,64.77 | U$1.BA2 8.26,73.66 13.97,73.66 15.24,74.93 v17.78,74.93 | v17.78,74.93 18.1,75.25 | U$1.AA2 8.26,3.81 13.97,3.81 15.24,5.08 v17.78,5.08 24.13,5.08 C5.1 | v17.78,74.93 19.05,74.93 | 19.05,74.93 v19.05,80.01 | 19.05,74.93 24.13,74.93 C6.1

### Text on the board
Bottom: Generic Mxxx, Double Height